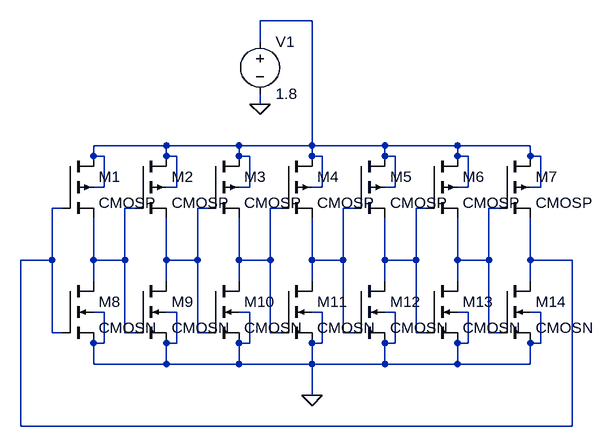
[diagram p0: schematic inverter_chain.asc]
inverter_chain.asc, the LTspice schematic file:
Version 4
SHEET 1 880 680
WIRE 304 -176 224 -176
WIRE 224 -144 224 -176
WIRE 224 -48 224 -64
WIRE 80 16 -32 16
WIRE 192 16 80 16
WIRE 304 16 304 -176
WIRE 304 16 192 16
WIRE 416 16 304 16
WIRE 528 16 416 16
WIRE 640 16 528 16
WIRE -32 32 -32 16
WIRE -16 32 -32 32
WIRE 80 32 80 16
WIRE 96 32 80 32
WIRE 192 32 192 16
WIRE 208 32 192 32
WIRE 304 32 304 16
WIRE 320 32 304 32
WIRE 416 32 416 16
WIRE 432 32 416 32
WIRE 528 32 528 16
WIRE 544 32 528 32
WIRE 640 32 640 16
WIRE 656 32 640 32
WIRE -16 80 -16 32
WIRE -16 80 -32 80
WIRE 96 80 96 32
WIRE 96 80 80 80
WIRE 208 80 208 32
WIRE 208 80 192 80
WIRE 320 80 320 32
WIRE 320 80 304 80
WIRE 432 80 432 32
WIRE 432 80 416 80
WIRE 544 80 544 32
WIRE 544 80 528 80
WIRE 656 80 656 32
WIRE 656 80 640 80
WIRE -80 112 -96 112
WIRE 32 112 16 112
WIRE 144 112 128 112
WIRE 256 112 240 112
WIRE 368 112 352 112
WIRE 480 112 464 112
WIRE 592 112 576 112
WIRE -96 192 -96 112
WIRE -96 192 -144 192
WIRE -32 192 -32 128
WIRE 16 192 16 112
WIRE 16 192 -32 192
WIRE 80 192 80 128
WIRE 128 192 128 112
WIRE 128 192 80 192
WIRE 192 192 192 128
WIRE 240 192 240 112
WIRE 240 192 192 192
WIRE 304 192 304 128
WIRE 352 192 352 112
WIRE 352 192 304 192
WIRE 416 192 416 128
WIRE 464 192 464 112
WIRE 464 192 416 192
WIRE 528 192 528 128
WIRE 576 192 576 112
WIRE 576 192 528 192
WIRE 640 192 640 128
WIRE 704 192 640 192
WIRE -32 224 -32 192
WIRE 80 224 80 192
WIRE 192 224 192 192
WIRE 304 224 304 192
WIRE 416 224 416 192
WIRE 528 224 528 192
WIRE 640 224 640 192
WIRE -16 272 -32 272
WIRE 96 272 80 272
WIRE 208 272 192 272
WIRE 320 272 304 272
WIRE 432 272 416 272
WIRE 544 272 528 272
WIRE 656 272 640 272
WIRE -96 304 -96 192
WIRE -80 304 -96 304
WIRE 16 304 16 192
WIRE 32 304 16 304
WIRE 128 304 128 192
WIRE 144 304 128 304
WIRE 240 304 240 192
WIRE 256 304 240 304
WIRE 352 304 352 192
WIRE 368 304 352 304
WIRE 464 304 464 192
WIRE 480 304 464 304
WIRE 576 304 576 192
WIRE 592 304 576 304
WIRE -16 320 -16 272
WIRE -16 320 -32 320
WIRE 96 320 96 272
WIRE 96 320 80 320
WIRE 208 320 208 272
WIRE 208 320 192 320
WIRE 320 320 320 272
WIRE 320 320 304 320
WIRE 432 320 432 272
WIRE 432 320 416 320
WIRE 544 320 544 272
WIRE 544 320 528 320
WIRE 656 320 656 272
WIRE 656 320 640 320
WIRE -32 352 -32 320
WIRE 80 352 80 320
WIRE 80 352 -32 352
WIRE 192 352 192 320
WIRE 192 352 80 352
WIRE 304 352 304 320
WIRE 304 352 192 352
WIRE 416 352 416 320
WIRE 416 352 304 352
WIRE 528 352 528 320
WIRE 528 352 416 352
WIRE 640 352 640 320
WIRE 640 352 528 352
WIRE 304 400 304 352
WIRE -144 448 -144 192
WIRE 704 448 704 192
WIRE 704 448 -144 448
FLAG 304 400 0
FLAG 224 -48 0
SYMBOL cmosp -80 32 R0
SYMATTR InstName M1
SYMATTR Value2 l=0.72u w=1.4u
SYMBOL cmosp 32 32 R0
SYMATTR InstName M2
SYMATTR Value2 l=0.72u w=1.4u
SYMBOL cmosp 144 32 R0
SYMATTR InstName M3
SYMATTR Value2 l=0.72u w=1.4u
SYMBOL cmosp 256 32 R0
SYMATTR InstName M4
SYMATTR Value2 l=0.72u w=1.4u
SYMBOL cmosp 368 32 R0
SYMATTR InstName M5
SYMATTR Value2 l=0.72u w=1.4u
SYMBOL cmosp 480 32 R0
SYMATTR InstName M6
SYMATTR Value2 l=0.72u w=1.4u
SYMBOL cmosp 592 32 R0
SYMATTR InstName M7
SYMATTR Value2 l=0.72u w=1.4u
SYMBOL cmosn -80 224 R0
SYMATTR InstName M8
SYMATTR Value2 l=0.18u w=0.35u
SYMBOL cmosn 32 224 R0
SYMATTR InstName M9
SYMATTR Value2 l=0.18u w=0.35u
SYMBOL cmosn 144 224 R0
SYMATTR InstName M10
SYMATTR Value2 l=0.18u w=0.35u
SYMBOL cmosn 256 224 R0
SYMATTR InstName M11
SYMATTR Value2 l=0.18u w=0.35u
SYMBOL cmosn 368 224 R0
SYMATTR InstName M12
SYMATTR Value2 l=0.18u w=0.35u
SYMBOL cmosn 480 224 R0
SYMATTR InstName M13
SYMATTR Value2 l=0.18u w=0.35u
SYMBOL cmosn 592 224 R0
SYMATTR InstName M14
SYMATTR Value2 l=0.18u w=0.35u
SYMBOL voltage 224 -160 R0
WINDOW 123 0 0 Left 0
WINDOW 39 0 0 Left 0
SYMATTR InstName V1
SYMATTR Value 1.8

The netlist it stands for:
* inverter_chain.asc
M1 N001 N002 N003 N001 CMOSP l=0.72u w=1.4u
M2 N001 N003 N004 N001 CMOSP l=0.72u w=1.4u
M3 N001 N004 N005 N001 CMOSP l=0.72u w=1.4u
M4 N001 N005 N006 N001 CMOSP l=0.72u w=1.4u
M5 N001 N006 N007 N001 CMOSP l=0.72u w=1.4u
M6 N001 N007 N008 N001 CMOSP l=0.72u w=1.4u
M7 N001 N008 N002 N001 CMOSP l=0.72u w=1.4u
M8 N003 N002 0 0 CMOSN l=0.18u w=0.35u
M9 N004 N003 0 0 CMOSN l=0.18u w=0.35u
M10 N005 N004 0 0 CMOSN l=0.18u w=0.35u
M11 N006 N005 0 0 CMOSN l=0.18u w=0.35u
M12 N007 N006 0 0 CMOSN l=0.18u w=0.35u
M13 N008 N007 0 0 CMOSN l=0.18u w=0.35u
M14 N002 N008 0 0 CMOSN l=0.18u w=0.35u
V1 N001 0 1.8
.model NMOS NMOS
.model PMOS PMOS
.lib standard.mos
.backanno
.end